# EasyEDA Pro project Charger Splitter.eprj, board PCB4
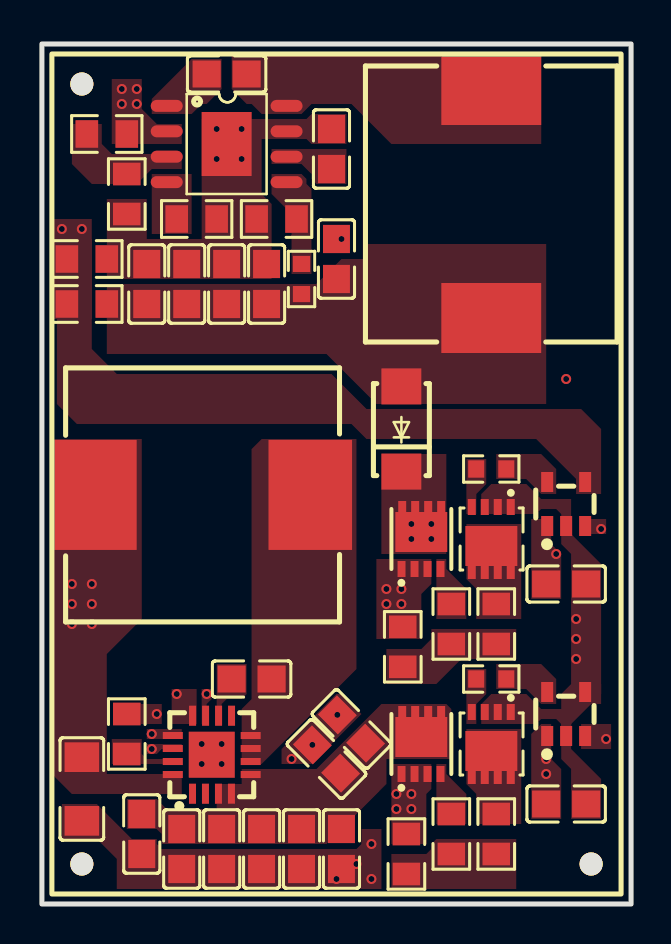
[diagram p11: board, top side]
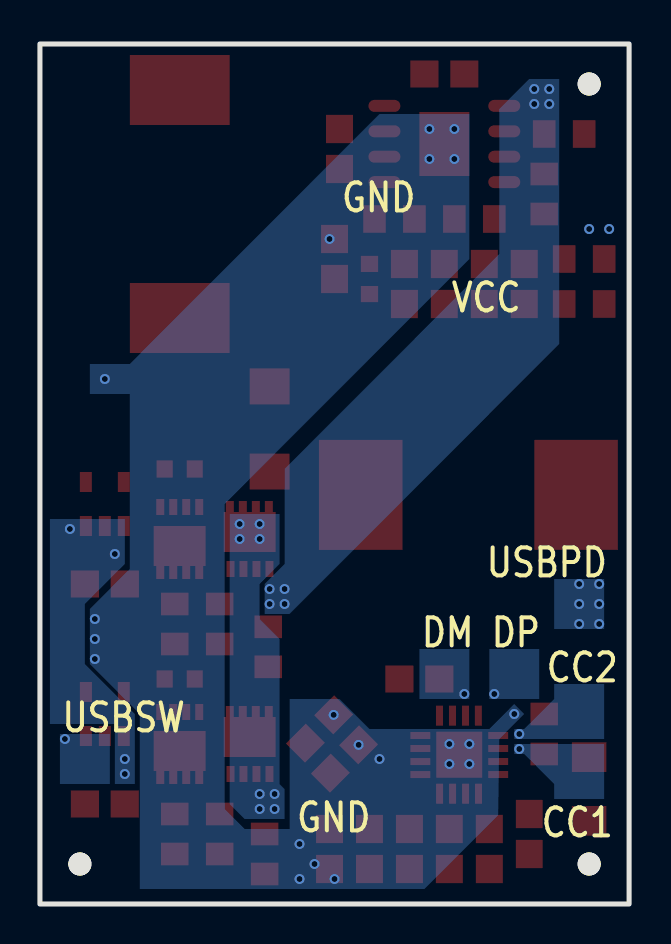
[diagram p12: board, bottom side, seen from below]

Outline 29.5 x 43 mm; copper layers: Top Layer, Bottom Layer. Coordinates in mm from the lower left corner of the outline.
Outline path: rectangle 0,43 29.5,0
Stack: Top Layer 0.035mm / Dielectric1 1.51mm FR4 er 4.5 / Bottom Layer 0.035mm

## Design rules (mm)
template: JLCPCB Capability(Two Layers Board)
spacing copperThickness1oz (default): track to track 0.102, other pairs 0.152 to 0.3
spacing copperThickness2oz: track to track 0.203, other pairs 0.152 to 0.3
track width copperThickness1oz (default): min 0.127, default 0.254, max 2.54
track width copperThickness2oz: min 0.203, default 0.254, max 2.54
differential pair differentialPair (default): width min 0.127, default 0.254, max 2.54; gap min 0.152, default 0.152
via viaSize (default): diameter min 0.5, default 0.61, max 10; hole min 0.3, default 0.305, max 6.3

## Placement (name value [footprint] x y rotation side)
BUCKC1  100nF  [C0805]  9.25 41.5 180 top
BUCKC2  10uF  [C0805]  5.25 31 90 top
BUCKC3  10uF  [C0805]  7.25 31 90 top
BUCKC4  10uF  [C0805]  9.25 31 90 top
BUCKC5  10uF  [C0805]  11.25 31 90 top
BUCKC6  10uF  [C0805]  14.75 32.25 90 top
BUCKD1  RSX501L-20TE25  [SMA_L4.5-W2.6-LS5.0-RD]  18 23.75 90 top
BUCKL1  15uH  [IND-SMD_L13.7-W12.6_MS1360]  22.5 35 270 top
BUCKR1  270kΩ  [R0805]  3.25 38.5 0 top
BUCKR2  13kΩ  [R0805]  4.25 35.5 90 top
BUCKR3  200kΩ  [R0805]  7.75 34.25 180 top
BUCKR4  75kΩ  [R0603]  13 31.25 90 top
BUCKR5  3kΩ  [R0805]  11.75 34.25 0 top
BUCKR6  13kΩ  [R0805]  2.25 30 0 top
BUCKR7  3kΩ  [R0805]  2.25 32.25 180 top
C22  10nF  [C0805]  14.5 37.75 90 top
C23  47uF  [C0805]  26.25 16 180 top
C24  47uF  [C0805]  26.25 5 180 top
HIGHQ1  SP40P18NJ  [DFN-8_L3.0-W3.0-P0.65-BL-EP_PE5G6EA]  19 18.25 0 top
HIGHQ2  AGM6014AP  [PDFN-8_L3.1-W3.0-P0.65-LS3.3-BL]  22.5 18.25 180 top
HIGHR1  2kΩ  [R0805]  18.07 12.86 90 top
HIGHR2  1kΩ  [R0805]  20.5 14 270 top
HIGHR3  1kΩ  [R0805]  22.75 14 270 top
HIGHU1  EG27517  [SOT-23-5_L2.9-W1.6-P0.95-LS2.8-BR]  26.25 20 270 top
LOWQ1  SP40P18NJ  [DFN-8_L3.0-W3.0-P0.65-BL-EP_PE5G6EA]  19 8 0 top
LOWQ2  AGM6014AP  [PDFN-8_L3.1-W3.0-P0.65-LS3.3-BL]  22.5 8 180 top
LOWR1  2kΩ  [R0805]  18.25 2.5 90 top
LOWR2  1kΩ  [R0805]  20.5 3.5 270 top
LOWR3  1kΩ  [R0805]  22.75 3.5 90 top
LOWU1  EG27517  [SOT-23-5_L2.9-W1.6-P0.95-LS2.8-BR]  26.25 9.5 270 top
NOREF  -  [Pad_e78]  2 2 0 top
NOREF#2  -  [Pad_e114]  2 41 0 top
NOREF#3  -  [Pad_e115]  27.5 2 0 top
PDBUCK1  AP64352SP-13  [SO-8_L4.9-W3.9-P1.27-LS6.0-BL-EP]  9.25 38 270 top
PDC1  100nF  [C0805]  10.5 11.25 180 top
PDC2  220uF  [C1206]  2 5.75 90 top
PDC3  10uF  [C0805]  7 2.75 90 top
PDC4  10uF  [C0805]  15.5 8.75 315 top
PDC5  10uF  [C0805]  14.25 7.25 315 top
PDC6  10uF  [C0805]  15 2.75 90 top
PDC7  10uF  [C0805]  5 3.5 90 top
PDC8  10uF  [C0805]  13 2.75 90 top
PDC9  10uF  [C0805]  11 2.75 90 top
PDC12  10uF  [C0805]  9 2.75 90 top
PDL1  33uH  [IND-SMD_L13.5-W12.5]  8.04 20.45 180 top
PDR1  10kΩ  [R0805]  4.25 8.5 90 top
R1  2Ω  [R0603]  22.5 21.75 180 top
R2  2Ω  [R0603]  22.5 11.25 180 top
USBPDREG1  XPM52CDP65  [QFN-16_L4.0-W4.0-P0.65-TL-EP2.3]  8.5 7.46 90 top

## Footprints (pads in the part's own frame, mm; a bottom-side part is the same pattern mirrored in y, then rotated)
C0805
  rect 1.41x1.35 smd: 1(-1,0) 2(1,0)
C1206
  rect 1.485x1.728 smd: 1(-1.593,0) 2(1.593,0)
DFN-8_L3.0-W3.0-P0.65-BL-EP_PE5G6EA
  rect 0.4x0.8 smd: 1(-0.992,-1.5) 2(-0.342,-1.5) 3(0.308,-1.5) 4(0.959,-1.5) 5(0.992,1.5) 6(0.342,1.5) 7(-0.309,1.5) 8(-0.959,1.5)
  rect 2.6x2 smd: 9(-0.004,0.35)
IND-SMD_L13.5-W12.5
  rect 4.185x5.5 smd: 1(-5.393,0) 2(5.393,0)
IND-SMD_L13.7-W12.6_MS1360
  rect 3.5x5 smd: 1(-5.7,0) 2(5.7,0)
Pad_e78
  round 1.152 hole 1.152: 1(0,0)
Pad_e114
  round 1.152 hole 1.152: 1(0,0)
Pad_e115
  round 1.152 hole 1.152: 1(0,0)
PDFN-8_L3.1-W3.0-P0.65-LS3.3-BL
  rect 0.4x0.8 smd: 1(-0.975,-1.6) 2(-0.325,-1.6) 3(0.325,-1.6) 4(0.975,-1.6) 5(0.975,1.6) 6(0.325,1.6) 7(-0.325,1.6) 8(-0.975,1.6)
  rect 2.6x2 smd: 9(-0.004,0.35)
QFN-16_L4.0-W4.0-P0.65-TL-EP2.3
  rect 1x0.35 smd: 1(-1.95,0.965) 2(-1.95,0.315) 3(-1.95,-0.336) 4(-1.95,-0.986) 9(1.95,-0.991) 10(1.95,-0.341) 11(1.95,0.31) 12(1.95,0.96)
  rect 0.35x1 smd: 5(-0.991,-1.95) 6(-0.341,-1.95) 7(0.31,-1.95) 8(0.96,-1.95) 13(0.96,1.95) 14(0.31,1.95) 15(-0.341,1.95) 16(-0.991,1.95)
  rect 2.3x2.3 smd: 17(0,0)
R0603
  rect 0.806x0.864 smd: 1(-0.753,0) 2(0.753,0)
R0805
  rect 1.133x1.377 smd: 1(-1,0) 2(1,0)
SMA_L4.5-W2.6-LS5.0-RD
  rect 1.8x2 smd: 1(-2.13,0) 2(2.13,0)
SO-8_L4.9-W3.9-P1.27-LS6.0-BL-EP
  oval 0.6x1.6 smd: 1(-1.905,-3) 2(-0.635,-3) 3(0.635,-3) 4(1.905,-3) 5(1.905,3) 6(0.635,3) 7(-0.635,3) 8(-1.905,3)
  rect 3.2x2.5 smd: 9(0,0)
SOT-23-5_L2.9-W1.6-P0.95-LS2.8-BR
  rect 1x0.6 smd: 1(1.1,-0.95) 2(1.1,0) 3(1.1,0.95) 4(-1.1,0.95) 5(-1.1,-0.95)

## Nets
As in the schematic, except:
$1N14078: HIGHQ2.5 HIGHQ2.6 HIGHQ2.7 HIGHQ2.8 HIGHQ2.9 HIGHR3.1
$1N14194: LOWQ2.5 LOWQ2.6 LOWQ2.7 LOWQ2.8 LOWQ2.9 LOWR3.2

Pads without a net: NOREF 1; NOREF#2 1; NOREF#3 1; USBPDREG1 1 2 9

## Via types
v1: diameter 0.5, hole 0.3, Top Layer to Bottom Layer, 54 vias

## Routing (per net, layer and track width the routed paths; a pad name or vN(x,y) marks a point on that pad's centre or on a via; arc(x,y) is an arc through that point)
+5V:
  vias: v1(25.25,7.25) v1(25.25,6.5) v1(25.75,17.5) v1(28,18.75)
GND:
  vias: v1(5.75,9.5) v1(8,8) v1(8,7) v1(8.75,38.75) v1(8.75,37.25) v1(9,8) v1(9,7) v1(10,38.75) v1(10,37.25) v1(12.5,7.25) v1(13.54,7.96) v1(14.79,9.46) v1(14.75,1.25) v1(15,33.25) v1(15.75,2) v1(16.5,3) v1(16.5,1.25) v1(26.25,26.25) v1(26.75,14.25) v1(26.75,13.25) v1(26.75,12.25)
VCC:
  vias: v1(4,40.75) v1(4,40) v1(4.75,40.75) v1(4.75,40) v1(17.25,15.75) v1(17.25,15) v1(18,15.75) v1(18,15)
USBCC1:
  vias: v1(5.5,7.75)
USBCC2:
  vias: v1(5.5,8.5)
USBD+:
  vias: v1(6.75,10.5)
USBD-:
  vias: v1(8.25,10.5)
USBPD:
  vias: v1(1.5,16) v1(1.5,15) v1(1.5,14) v1(2.5,16) v1(2.5,15) v1(2.5,14)
USBPDSW:
  vias: v1(28.25,8.25)
UVLOENOUT:
  vias: v1(1,33.75) v1(2,33.75)
$1N10648:
  vias: v1(17.75,5.5) v1(17.75,4.75) v1(18.5,19) v1(18.5,18.25) v1(18.5,5.5) v1(18.5,4.75) v1(19.5,19) v1(19.5,18.25)

## Copper pours and planes (outline as drawn; the poured copper is in the pictures)
+5V on Top Layer: 24.5,19.25 26,19.25 26,15.25 24.5,15.25
+5V on Top Layer: 24.5,9 26,9 26,4.25 24.5,4.25
+5V on Bottom Layer: 24.75,19.25 29,19.25 29,6 24.75,6
GND on Top Layer: 3.75,10 6,10 6,9 3.75,9
GND on Top Layer: 26,19.25 28,19.25 28,10 26,10
GND on Top Layer: 3.25,39.25 11.5,39.25 11.5,31.25 3.25,31.25
GND on Top Layer: 26,11 28,11 28,4.25 26,4.25
GND on Top Layer: 12,10.5 16,10.5 16,7 12,7
GND on Top Layer: 22,21 26.5,21 26.5,18.5 22,18.5
GND on Top Layer: 22,10.5 26.5,10.5 26.5,8 22,8
GND on Top Layer: 1,5 17,5 17,0.75 1,0.75
GND on Top Layer: 10.5,39.5 15.25,39.5 15.25,38 10.5,38
GND on Bottom Layer: 24.75,27 27,27 27,25.5 24.75,25.5
GND on Bottom Layer: 5.25,39.5 27,39.5 27,0.75 5.25,0.75
VCC on Top Layer: 3.5,41.25 7,41.25 7,38 3.5,38
VCC on Top Layer: 16.75,17.25 19.5,17.25 19.5,13.25 16.75,13.25
VCC on Bottom Layer: 3.5,41.25 18.25,41.25 18.25,14.5 3.5,14.5
USBCC1 on Bottom Layer: 1.25,8 5.75,8 5.75,5.25 1.25,5.25
USBCC2 on Bottom Layer: 1.25,11 5.75,11 5.75,8.25 1.25,8.25
USBD+ on Top Layer: 6.5,10.75 7.75,10.75 7.75,9 6.5,9
USBD+ on Bottom Layer: 4.5,12.75 7,12.75 7,10.25 4.5,10.25
USBD- on Bottom Layer: 8,12.75 10.5,12.75 10.5,10.25 8,10.25
USBPD on Top Layer: 0.5,23.25 7,23.25 7,5.5 0.5,5.5
USBPD on Bottom Layer: 1.25,16.25 3.75,16.25 3.75,13.75 1.25,13.75
USBPDSW on Top Layer: 27,9 28.5,9 28.5,7.75 27,7.75
USBPDSW on Bottom Layer: 26,8.5 28.5,8.5 28.5,6 26,6
UVLOENOUT on Top Layer: 0.75,33.25 28,33.25 28,20.5 0.75,20.5
UVLOENOUT on Top Layer: 0.5,34.25 2.5,34.25 2.5,29.25 0.5,29.25
$1N1848 on Top Layer: 4.25,5.25 6.25,5.25 6.25,3 4.25,3
$1N1848 on Top Layer: 6,10 20.5,10 20.5,3 6,3
$1N1850 on Top Layer: 10,23.25 15.75,23.25 15.75,7 10,7
$1N1852 on Top Layer: 8.75,12 10.25,12 10.25,9 8.75,9
$1N1856 on Top Layer: 3.5,8.25 7,8.25 7,7 3.5,7
$1N1863 on Top Layer: 1.5,39 7,39 7,36 1.5,36
$1N1864 on Top Layer: 9.5,42.5 25,42.5 25,38 9.5,38
$1N1867 on Top Layer: 5.5,36.5 7.5,36.5 7.5,33.5 5.5,33.5
$1N1868 on Top Layer: 11.5,36.5 13.5,36.5 13.5,31.5 11.5,31.5
$1N1870 on Top Layer: 11.5,37.75 15.25,37.75 15.25,36 11.5,36
$1N1871 on Top Layer: 3.25,33 25.25,33 25.25,25 3.25,25
$1N7478 on Top Layer: 17.5,3.25 23.75,3.25 23.75,0.75 17.5,0.75
$1N7609 on Top Layer: 17.25,13.75 23.75,13.75 23.75,11 17.25,11
$1N9286 on Top Layer: 21.25,22.25 22.25,22.25 22.25,19.5 21.25,19.5
$1N9327 on Top Layer: 22.75,22.5 25.75,22.5 25.75,20.5 22.75,20.5
$1N9376 on Top Layer: 21.25,11.75 22.25,11.75 22.25,9 21.25,9
$1N9380 on Top Layer: 22.75,12 25.75,12 25.75,10 22.75,10
$1N10648 on Top Layer: 17.5,7 19.5,7 19.5,3 17.5,3
$1N10648 on Top Layer: 17,22.5 20.25,22.5 20.25,17.5 17,17.5
$1N10648 on Bottom Layer: 17.25,19.5 20,19.5 20,4.25 17.25,4.25
$1N10681 on Top Layer: 5.5,42.25 9,42.25 9,39.5 5.5,39.5
$1N14039 on Top Layer: 19.75,17.25 21.25,17.25 21.25,14.25 19.75,14.25
$1N14078 on Top Layer: 21.25,19 24,19 24,14.25 21.25,14.25
$1N14155 on Top Layer: 19.75,7 21.25,7 21.25,4 19.75,4
$1N14194 on Top Layer: 21.25,8.75 24,8.75 24,4 21.25,4

Small or netless copper shapes (teardrops, artwork), in the pictures only: 5 on Top Layer

## Text on the board
Bottom Silkscreen Layer: CC2 | CC1 | DP | USBPD | VCC | DM | GND | USBSW
